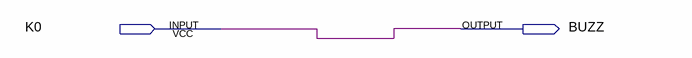
[diagram p0: schematic sheet]
// Quartus schematic buzzer.bdf as structural Verilog: 0 symbols, 2 pins
module buzzer (
  input  K0,
  output BUZZ
);


  assign BUZZ = K0;
endmodule
